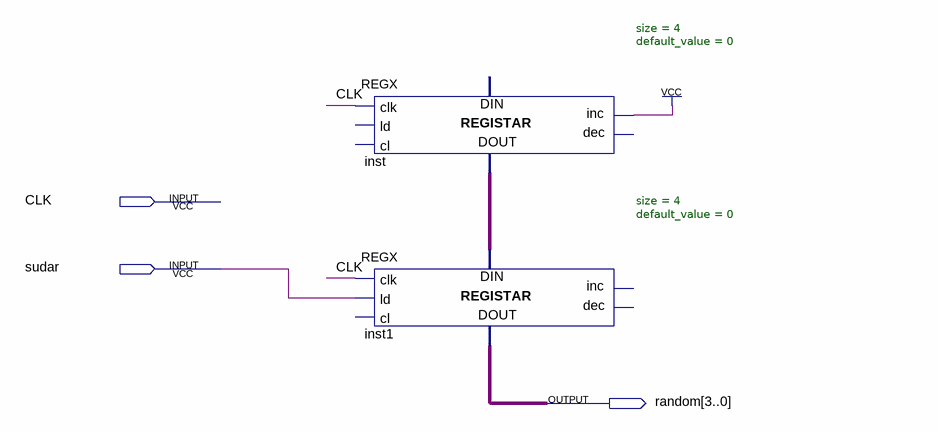
[diagram p0: schematic sheet]
// Quartus schematic RAND1.bdf as structural Verilog: 2 symbols, 3 pins
module RAND1 (
  input  CLK,
  input  sudar,
  output [3:0] random
);

  wire [3:0] inst_data_out;

  REGX #(.size(4), .default_value(0)) inst (
    .clk(CLK), .inc(1'b1), .data_out(inst_data_out));  // open: ld, cl, dec, data_in
  REGX #(.size(4), .default_value(0)) inst1 (
    .clk(CLK), .ld(sudar), .data_in(inst_data_out), .data_out(random));  // open: cl, inc, dec
endmodule
